# Altium schematic sheet Microcontroller.SchDoc
size A4
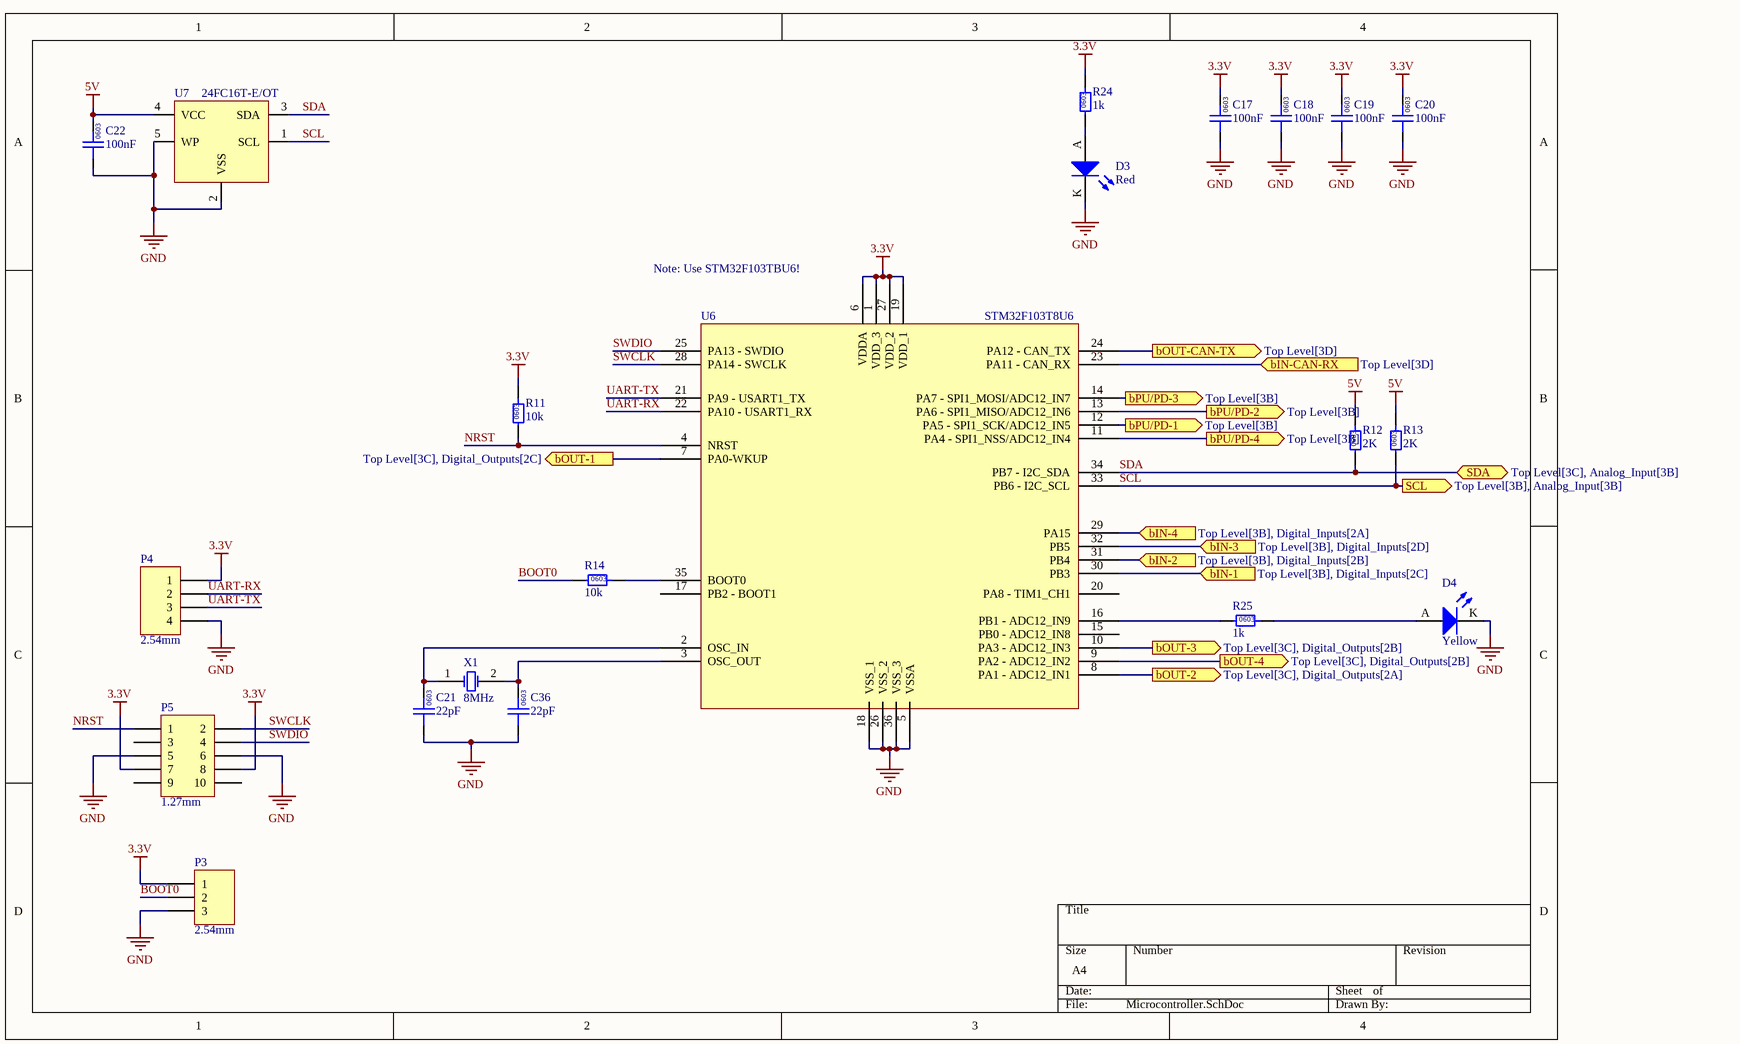
[diagram p0: Microcontroller.SchDoc]

## Parts
C17  100nF  [0603]
C18  100nF  [0603]
C19  100nF  [0603]
C20  100nF  [0603]
C21  22pF  [0603]
C22  100nF  [0603]
C36  22pF  [0603]
D3  Red  [0805 LED]
D4  Yellow  [0805 LED]
P3  2.54mm  [TH 2.54mm Header 1x3]
P4  2.54mm  [TH 2.54mm Header 1x4]
P5  1.27mm  [3221-10-0300-00]
R11  10k  [0603]
R12  2K  [0603]
R13  2K  [0603]
R14  10k  [0603]
R24  1k  [0603]
R25  1k  [0603]
U6  STM32F103T8U6  [STM_QFN-36]
U7  24FC16T-E/OT  [MCP SOT-23-5]
X1  8MHz  [ECS-80-18-30-JGN-TR]

## Ports
bIN-1 (in, see Top Level[3B], Digital_Inputs[2C]), bIN-2 (in, see Top Level[3B], Digital_Inputs[2B]), bIN-3 (in, see Top Level[3B], Digital_Inputs[2D]), bIN-4 (in, see Top Level[3B], Digital_Inputs[2A]), bIN-CAN-RX (in, see Top Level[3D]), bOUT-1 (out, see Top Level[3C], Digital_Outputs[2C]), bOUT-2 (out, see Top Level[3C], Digital_Outputs[2A]), bOUT-3 (out, see Top Level[3C], Digital_Outputs[2B]), bOUT-4 (out, see Top Level[3C], Digital_Outputs[2B]), bOUT-CAN-TX (out, see Top Level[3D]), bPU/PD-1 (out, see Top Level[3B]), bPU/PD-2 (out, see Top Level[3B]), bPU/PD-3 (out, see Top Level[3B]), bPU/PD-4 (out, see Top Level[3B]), SCL (out, see Top Level[3B], Analog_Input[3B]), SDA (bidir, see Top Level[3C], Analog_Input[3B])

## Nets
3.3V: C17.2 C18.2 C19.2 C20.2 P3.1 P4.1 P5.7 P5.8 R11.2 R24.2 U6.1(VDD_3) U6.6(VDDA) U6.19(VDD_1) U6.27(VDD_2)
5V: C22.2 R12.2 R13.2 U7.4(VCC)
GND: C17.1 C18.1 C19.1 C20.1 C21.1 C22.1 C36.1 D3.K D4.K P3.3 P4.4 P5.5 P5.6 U6.5(VSSA) U6.18(VSS_1) U6.26(VSS_2) U6.36(VSS_3) U7.2(VSS) U7.5(WP)
bIN-1: U6.30(PB3) ; port bIN-1
bIN-2: U6.31(PB4) ; port bIN-2
bIN-3: U6.32(PB5) ; port bIN-3
bIN-4: U6.29(PA15) ; port bIN-4
bIN-CAN-RX: U6.23(PA11_-_CAN_RX) ; port bIN-CAN-RX
BOOT0: P3.2 R14.1
bOUT-1: U6.7(PA0-WKUP) ; port bOUT-1
bOUT-2: U6.8(PA1_-_ADC12_IN1) ; port bOUT-2
bOUT-3: U6.10(PA3_-_ADC12_IN3) ; port bOUT-3
bOUT-4: U6.9(PA2_-_ADC12_IN2) ; port bOUT-4
bOUT-CAN-TX: U6.24(PA12_-_CAN_TX) ; port bOUT-CAN-TX
bPU/PD-1: U6.12(PA5_-_SPI1_SCK/ADC12_IN5) ; port bPU/PD-1
bPU/PD-2: U6.13(PA6_-_SPI1_MISO/ADC12_IN6) ; port bPU/PD-2
bPU/PD-3: U6.14(PA7_-_SPI1_MOSI/ADC12_IN7) ; port bPU/PD-3
bPU/PD-4: U6.11(PA4_-_SPI1_NSS/ADC12_IN4) ; port bPU/PD-4
NRST: P5.1 R11.1 U6.4(NRST)
SCL: R13.1 U6.33(PB6_-_I2C_SCL) U7.1(SCL) ; port SCL
SDA: R12.1 U6.34(PB7_-_I2C_SDA) U7.3(SDA) ; port SDA
SWCLK: P5.2 U6.28(PA14_-_SWCLK)
SWDIO: P5.4 U6.25(PA13_-_SWDIO)
UART-RX: P4.2 U6.22(PA10_-_USART1_RX)
UART-TX: P4.3 U6.21(PA9_-_USART1_TX)
NetC21_2: C21.2 U6.2(OSC_IN) X1.1(OSC1)
NetC36_2: C36.2 U6.3(OSC_OUT) X1.2(OSC2)
NetD3_A: D3.A R24.1
NetD4_A: D4.A R25.2
NetR14_2: R14.2 U6.35(BOOT0)
NetR25_1: R25.1 U6.16(PB1_-_ADC12_IN9)

Not connected (* = marked no-connect by the designer): P5 3 9 10; U6 15(PB0_-_ADC12_IN8) 17(PB2_-_BOOT1_) 20(PA8_-_TIM1_CH1)

## Notes on the sheet
- (near U6) Note: Use STM32F103TBU6!
- (in symbol GCM188L81H104KA57D) 0603
- (in symbol GRM0335C1H220JA01D) 0603
- (in symbol RC0603FR-071KL) 0603
- (in symbol RC0603FR-072KL) 0603
- (in symbol RC0603FR-0710KL) 0603

## Library data of the parts
C17-C20 C22 = GCM188L81H104KA57D: Manufacturer: muRata; Rated Voltage: 50V; Tolerance: ±10%; Material: MLCC; Temperature Rating: X8L; Part Number: GCM188L81H104KA57D; Value: 100nF; Digikey Part Number: 490-6049-1-ND
C21 C36 = GRM0335C1H220JA01D: Manufacturer: Murata Electronics; Rated Voltage: 50V; Tolerance: ±5%; Material: MLCC; Temperature Rating: C0G, NP0; Part Number: GRM0335C1H220JA01D; Value: 22pF; Digikey Part Number: 490-6123-1-ND
D3 = SML-210LTT86: Red LED Indication - Discrete 1.75V 0805 (2012 Metric); Manufacturer: ROHM Semiconductor; Part Number: SML-210LTT86; Colour: Red; Digikey Part Number: 511-1286-1-ND
D4 = SML-211YTT86: Yellow LED Indication - Discrete 1.75V 0805 (2012 Metric); Manufacturer: ROHM Semiconductor; Part Number: SML-211YTT86; Colour: Yellow; Digikey Part Number: 511-1293-1-ND
P3 = TH 2.54mm Header 1x3: Positions: 3; Angle: 0; Flange: No; Contact: NA; Part Number: TH 2.54mm Header 1x3; Pitch: 2.54mm; Row Spacing: 2.54mm
P4 = TH 2.54mm Header 1x4: Positions: 4; Angle: 0; Flange: No; Contact: NA; Part Number: TH 2.54mm Header 1x4; Pitch: 2.54mm; Row Spacing: 2.54mm
P5 = SMD 1.27mm Header 2x5 (3221-10-0300-00): Positions: 10; Angle: 0; Flange: No; Contact: NA; Part Number: SMD 1.27mm Header 2x5 (3221-10-0300-00); Pitch: 1.27mm; Row Spacing: 1.27mm
R11 R14 = RC0603FR-0710KL: Manufacturer: YAGEO; Tolerance: 0.01; Rated Power: 0.1W; Part Number: RC0603FR-0710KL; Value: 10k; Material: FR-07; Digikey Part Number: 311-10.0KHRCT-ND
R12 R13 = RC0603FR-072KL: Manufacturer: YAGEO; Tolerance: 0.01; Rated Power: 0.1W; Part Number: RC0603FR-072KL; Value: 2K; Material: FR-07; Digikey Part Number: 311-2.00KHRCT-ND
R24 R25 = RC0603FR-071KL: Manufacturer: YAGEO; Tolerance: 0.01; Rated Power: 0.1W; Part Number: RC0603FR-071KL; Value: 1k; Material: FR-07; Digikey Part Number: 311-1.00KHRCT-ND
U6 = STM32F103T8U6: ARM® Cortex®-M3 STM32F1 Microcontroller IC 32-Bit 72MHz 64KB (64K x 8) FLASH QFN; Manufacturer: ST Microelectronics; Complex IC: 1; Part Number: STM32F103T8U6; Digikey Part Number: STM32F103T8U6; Digikey Link: https://www.digikey.com/en/products/detail/stmicroelectronics/stm32f103t8u6/1852493
U7 = 24FC16T-E/OT: IC EEPROM 16KBIT I2C SOT23-5; Manufacturer: Microchip Technology; Complex IC: 0; Part Number: 24FC16T-E/OT; Digikey Part Number: 150-24FC16T-E/OTCT-ND
X1 = ECS-80-18-30-JGN-TR: Manufacturer: ECS Inc; Load Capacitance: 18pF; ESR: 100R; Part Number: ECS-80-18-30-JGN-TR; Value: 8MHz; Digikey Part Number: XC2103CT-ND; Digikey Link: https://www.digikey.com/en/products/detail/ecs-inc/ECS-80-18-30-JGN-TR/5875530